# EAGLE design OLED_Adapter (EAGLE 9.5.2)
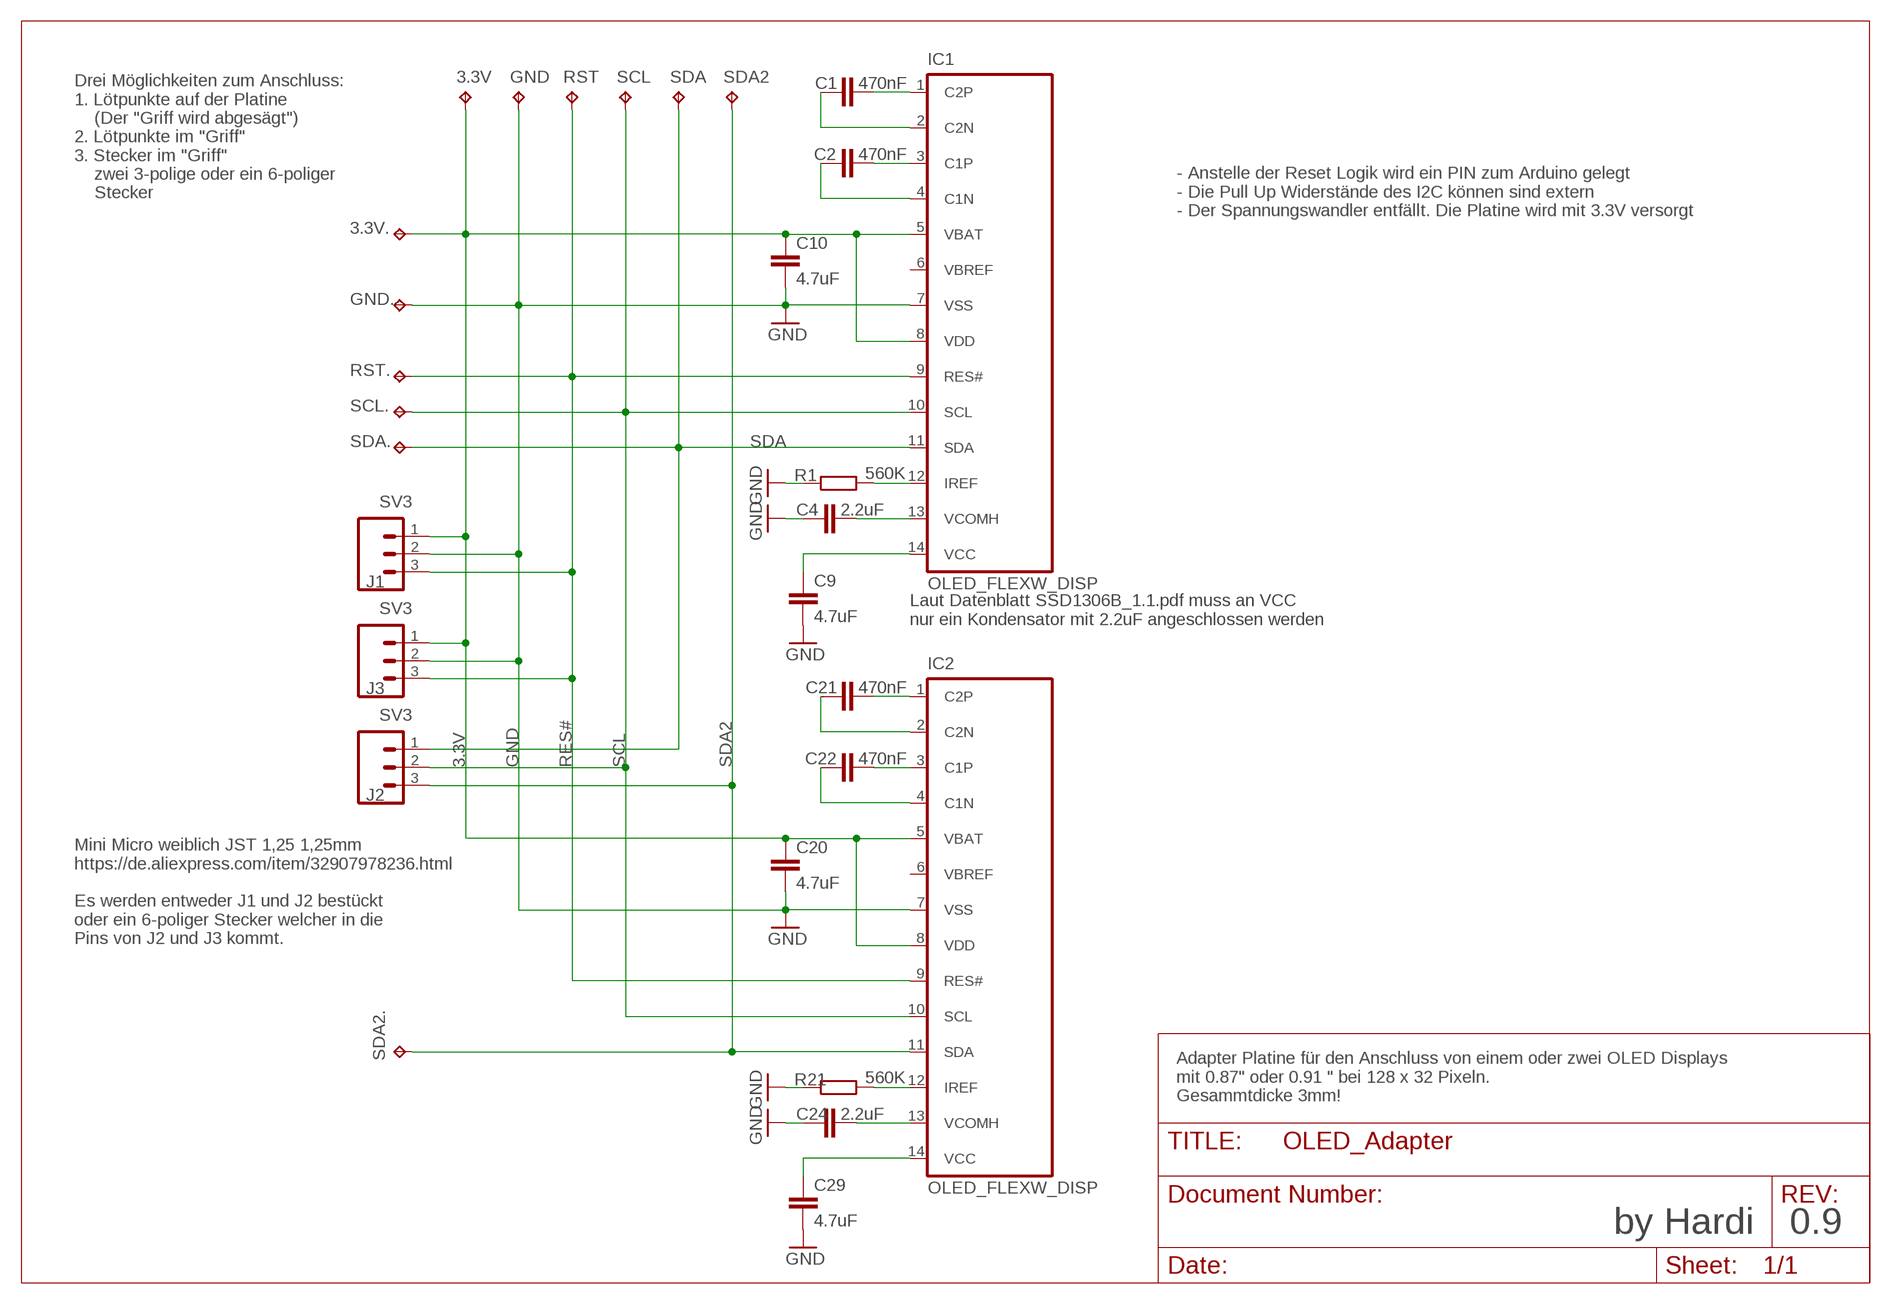
[diagram p0: schematic, sheet 1]

## Parts
3.3V  3.3V  TPTP16SQ  [TP16SQ]
3.3V.  TPTP16SQ  [TP16SQ]
C1  470nF  C-EUC0603  [C0603]
C2  470nF  C-EUC0603  [C0603]
C4  2.2uF  C-EUC0603  [C0603]
C9  4.7uF  C-EUC0603  [C0603]
C10  4.7uF  C-EUC0603  [C0603]
C20  4.7uF  C-EUC0603  [C0603]
C21  470nF  C-EUC0603  [C0603]
C22  470nF  C-EUC0603  [C0603]
C24  2.2uF  C-EUC0603  [C0603]
C29  4.7uF  C-EUC0603  [C0603]
GND  GND  TPTP16R  [TP16R]
GND.  TPTP16R  [TP16R]
IC1  OLED_FLEXW_DISP  [OLED_FLEX_W_DISP]
IC2  OLED_FLEXW_DISP  [OLED_FLEX_W_DISP]
J1  SV3  M03  [MINI]
J2  SV3  M03  [MINI]
J3  SV3  M03  [MINI]
R1  560K  R-EU_R0603  [R0603]
R21  560K  R-EU_R0603  [R0603]
RST  RST  TPTP16R  [TP16R]
RST.  TPTP16R  [TP16R]
SCL  SCL  TPTP16R  [TP16R]
SCL.  TPTP16R  [TP16R]
SDA  SDA  TPTP16R  [TP16R]
SDA2  SDA2  TPTP16R  [TP16R]
SDA2.  TPTP16R  [TP16R]
SDA.  TPTP16R  [TP16R]

## Nets
3.3V: 3.3V..TP 3.3V.TP C10.1 C20.1 IC1.5(VBAT) IC1.8(VDD) IC2.5(VBAT) IC2.8(VDD) J1.1 J3.1
GND: C4.1 C9.2 C10.2 C20.2 C24.1 C29.2 GND..TP GND.TP IC1.7(VSS) IC2.7(VSS) J1.2 J3.2 R1.1 R21.1
N$1: IC1.12(IREF) R1.2
N$2: C21.2 IC2.1(C2P)
N$3: C1.2 IC1.1(C2P)
N$4: C1.1 IC1.2(C2N)
N$5: C2.2 IC1.3(C1P)
N$6: C2.1 IC1.4(C1N)
N$7: C9.1 IC1.14(VCC)
N$8: C4.2 IC1.13(VCOMH)
N$9: C21.1 IC2.2(C2N)
N$10: C22.2 IC2.3(C1P)
N$11: C22.1 IC2.4(C1N)
N$12: IC2.12(IREF) R21.2
N$13: C29.1 IC2.14(VCC)
N$14: C24.2 IC2.13(VCOMH)
RES#: IC1.9(RES#) IC2.9(RES#) J1.3 J3.3 RST..TP RST.TP
SCL: IC1.10(SCL) IC2.10(SCL) J2.2 SCL..TP SCL.TP
SDA: IC1.11(SDA) J2.1 SDA..TP SDA.TP
SDA2: IC2.11(SDA) J2.3 SDA2..TP SDA2.TP
Unconnected: IC1.6(VBREF) IC2.6(VBREF)

## Notes on the sheet
- Drei Möglichkeiten zum Anschluss:
  1. Lötpunkte auf der Platine
      (Der "Griff wird abgesägt")
  2. Lötpunkte im "Griff"
  3. Stecker im "Griff"
      zwei 3-polige oder ein 6-poliger
      Stecker
- - Anstelle der Reset Logik wird ein PIN zum Arduino gelegt
  - Die Pull Up Widerstände des I2C können sind extern
  - Der Spannungswandler entfällt. Die Platine wird mit 3.3V versorgt
- Laut Datenblatt SSD1306B_1.1.pdf muss an VCC
  nur ein Kondensator mit 2.2uF angeschlossen werden
- Mini Micro weiblich JST 1,25 1,25mm
  https://de.aliexpress.com/item/32907978236.html
  
  Es werden entweder J1 und J2 bestückt
  oder ein 6-poliger Stecker welcher in die
  Pins von J2 und J3 kommt.
- Adapter Platine für den Anschluss von einem oder zwei OLED Displays 
  mit 0.87" oder 0.91 " bei 128 x 32 Pixeln.
  Gesammtdicke 3mm!
- by Hardi | 0.9

## Library data of the parts
3.3V 3.3V. GND GND. RST RST. SCL SCL. SDA SDA2 SDA2. SDA. = testpad:TP: Test pad
C1 C2 C4 C9 C10 C20-C22 C24 C29 = resistor:C-EU: CAPACITOR, European symbol
IC1 IC2 = OLED_Flex:OLED_FLEX: 14-Pin OLED Conector 0.91" or 0.86 " Source: https://www.buydisplay.com/white-0-87-inch-oled-display-panel-128x32-iic-i2c-ssd1316 ER-OLED0.87-1_Datasheet.pdf by Hardi
J1-J3 = SparkFun-Connectors:M03: Header 3 Standard 3-pin 0.1" header. Use with straight break away headers (SKU : PRT-00116), right angle break away headers (PRT-00553), swiss pins (PRT-00743), machine pins (PRT-00117), and female headers (PRT-00115). Molex polarized connector foot print use with SKU : PRT-08232 with associated crimp pins and housings.
R1 R21 = rcl:R-EU_: RESISTOR, European symbol; SPICEPREFIX: R

## Board
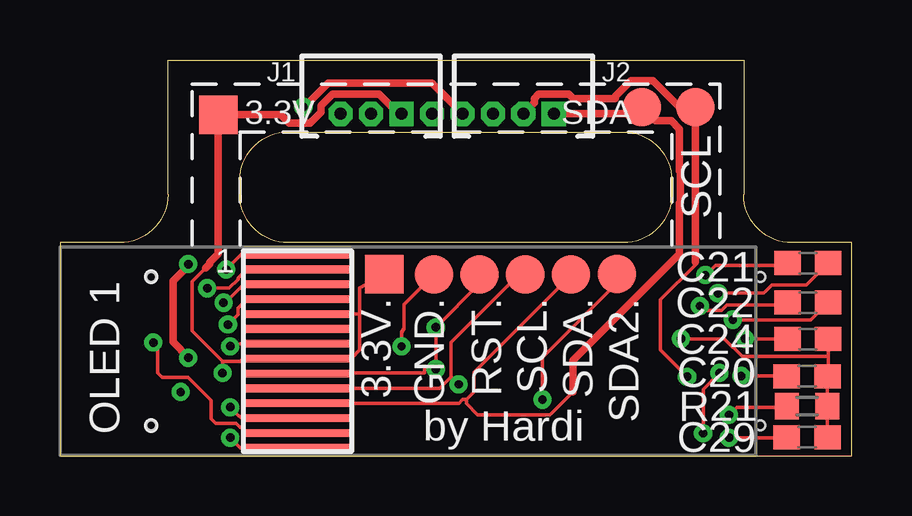
[diagram p1: board, top side]
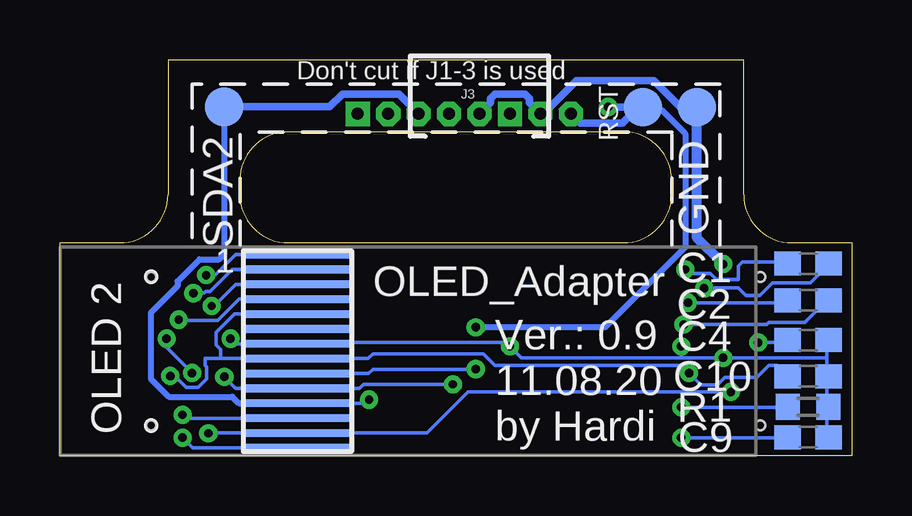
[diagram p2: board, bottom side, seen from below]

Size 33 x 16.5 mm. Coordinates in mm from the lower left corner, seen from the top.
Outline: 0,0 33,0 33,8.88 30.5,8.88 arc-90 28.5,10.88 28.5,16.5 4.5,16.5 4.5,10.88 arc-90 2.5,8.88 0,8.88 0,0
Outline: 23.5,8.88 9.5,8.88 arc-90 7.5,10.88 7.5,11.5 arc-90 9.5,13.5 23.5,13.5 arc-90 25.5,11.5 25.5,10.88 arc-90 23.5,8.88
Copper layers (1*16): Top 0.035mm / dielectric 1.5mm / Bottom 0.035mm
Design rules "default *": minimum track width 6mil, minimum drill 0.35mm, track to track 6mil, track to pad 6mil, pad to pad 6mil, via to via 6mil, smd to smd 6mil, copper to edge 8mil, drill to drill 6mil, minimum pad ring 10mil, minimum via ring 8mil, stop-mask expansion 4mil, vias tented up to drill 0mil, thermal gap 10mil

### Footprints (pad centres in the part's own frame; a part is rotated, then mirrored left to right if it is on the bottom)
TP16SQ = smd 1.6 x 1.6: TP 0,0
C0603 = smd 1.1 x 1: 1 -0.85,0; 2 0.85,0
TP16R = smd 1.6 x 1.6: TP 0,0
OLED_FLEX_W_DISP = smd 4.5 x 0.32: 1 0,0; 2 0,-0.62; 3 0,-1.24; 4 0,-1.86; 5 0,-2.48; 6 0,-3.1; 7 0,-3.72; 8 0,-4.34; 9 0,-4.96; 10 0,-5.58; 11 0,-6.2; 12 0,-6.82; 13 0,-7.44; 14 0,-8.06 | hole 0.4: -6.1,-0.93; -6.1,-7.13
MINI = drill 0.5 pad 1.016 square: 1 -1.27,0 | drill 0.5 pad 1.016 octagon: 2 0,0; 3 1.27,0
R0603 = smd 1 x 1.1: 1 -0.85,0; 2 0.85,0

### Placement (x,y rotation side)
3.3V  6.6,14.22 0 top
3.3V.  13.53,7.56 0 top
C1  1.81,8 180 bottom
C2  1.81,6.48 180 bottom
C4  1.81,4.83 180 bottom
C9  1.81,0.76 0 bottom
C10  1.81,3.3 0 bottom
C20  31.15,3.3 0 top
C21  31.18,8.03 180 top
C22  31.18,6.38 180 top
C24  31.18,4.86 180 top
C29  31.15,0.76 0 top
GND  6.44,14.53 0 bottom
GND.  15.59,7.56 0 top
IC1  9.91,8.38 0 top
IC2  23.09,8.38 0 bottom
J1  12.97,14.26 180 top
J2  19.32,14.26 180 top
J3  15.51,14.26 180 bottom
R1  1.81,2.03 180 bottom
R21  31.15,2.06 180 top
RST  8.7,14.53 0 bottom
RST.  17.49,7.56 0 top
SCL  26.48,14.53 0 top
SCL.  19.4,7.56 0 top
SDA  24.26,14.53 0 top
SDA2  26.16,14.54 0 bottom
SDA2.  23.22,7.57 0 top
SDA.  21.3,7.56 0 top

### Tracks (layer width: path | path; a pad name or v marks a point on that pad's centre or on a via)
3.3V  (via drill 0.35)
  Top 0.152: 3.3V..TP 12.49,6.98 12.49,5.86 | 6.78,3.92 5.51,5.19 5.51,7.26 6.07,7.82 | 6.78,3.92 7.51,3.92 7.63,4.04 IC1.8 9.95,4.08 12.18,4.08 12.49,4.4 12.49,5.86 | v28.4,3.32 30.27,3.32 C20.1 | v6.78,3.45 6.78,3.92 | IC1.5 12.45,5.9 12.49,5.86
  Top 0.305: 6.07,7.82 6.25,7.99 6.25,8.04 6.6,8.4 3.3V.TP 9.2,14.22 9.56,13.86 9.79,13.86 10.43,13.86 10.89,14.31 10.89,14.59 11.36,15.07 13.31,15.07 14.12,14.26 J3.1
  Bottom 0.152: C10.1 2.78,3.45 3.1,3.76 3.45,3.76 3.95,3.26 5.28,3.26 5.59,2.96 6.29,2.96 v6.78,3.45 6.78,3.76 14.88,3.76 15.35,4.24 19.95,4.24 20.15,4.04 IC2.8 26.3,4.04 | 26.3,4.04 26.95,4.04 26.95,3.76 26.89,3.7 26.89,3.19 27.24,2.84 27.74,2.84 28.22,3.32 v28.4,3.32 | 26.3,4.04 26.3,4.43 26.5,4.62 26.5,5.12 25.72,5.9 IC2.5
GND  (via drill 0.35)
  Top 0.152: v14.24,4.55 14.24,5.13 14.34,5.31 14.34,6.3 GND..TP | v7.1,4.56 7.13,4.56 7.23,4.66 IC1.7 | v25.89,4.87 27.7,4.87 28.44,4.13 32,4.13 32.03,4.1 | 5.35,4.1 v5.35,4.08 | C24.1 32.03,4.1 | 32.03,4.1 32.03,3.33 C20.2 R21.1 C29.2
  Top 0.305: v5.35,7.98 5.35,7.91 4.71,7.27 4.71,4.73 5.35,4.1
  Bottom 0.152: C9.2 1.03,0.91 1.03,2.02 R1.1 1.03,2.17 1.03,3.29 C10.2 1.03,3.45 1.03,4.08 | 1.03,4.08 1.03,4.71 C4.1 | 7.1,4.08 13.77,4.08 v14.24,4.55 14.4,4.71 22.97,4.71 IC2.7 25.89,4.66 v25.89,4.87 | 7.1,4.08 v5.35,4.08 1.03,4.08 | 7.1,4.08 v7.1,4.56
  Bottom 0.305: GND.TP 7.14,14.53 8.24,15.64 11.47,15.64 12.85,14.26 J1.2 13.43,14.71 13.43,14.89 13.61,15.07 14.87,15.07 15.05,14.89 15.05,14.71 J3.2
  Bottom 0.406: v5.35,7.98 6.45,9.08 GND.TP
N$1  (via drill 0.35)
  Top 0.152: IC1.12 7.57,1.56 7.47,1.66 7.46,1.66 v7.1,2.02
  Bottom 0.152: v7.1,2.02 2.78,2.02 R1.2
N$2  (via drill 0.35)
  Top 0.152: C21.2 30.23,7.93 27.31,7.93 v26.91,7.53
  Bottom 0.152: IC2.1 25.67,8.38 26.53,7.53 v26.91,7.53
N$3  (via drill 0.35)
  Top 0.152: IC1.1 7.78,8.38 7.76,8.4 7.57,8.4 v6.93,7.76
  Bottom 0.152: v6.93,7.76 6.76,7.59 5.89,7.59 5.64,7.34 4.71,7.34 4.71,7.91 4.54,8.08 2.74,8.08 C1.2
N$4  (via drill 0.35)
  Top 0.152: v6.14,6.98 7.06,6.98 7.43,7.35 7.43,7.4 7.79,7.76 IC1.2
  Bottom 0.152: C1.1 1.03,7.89 1.72,7.21 3.3,7.21 3.83,6.68 4.41,6.68 4.71,6.98 v6.14,6.98
N$5  (via drill 0.35)
  Top 0.152: IC1.3 7.65,7.14 6.88,6.37 v6.82,6.37
  Bottom 0.152: v6.82,6.37 2.76,6.37 C2.2
N$6  (via drill 0.35)
  Top 0.152: v7,5.46 7.43,5.89 7.43,6.16 7.79,6.52 IC1.4
  Bottom 0.152: C2.1 1.03,6.46 1.94,5.55 3.45,5.55 3.54,5.46 v7,5.46
N$7  (via drill 0.35)
  Top 0.152: IC1.14 7.52,0.32 v7.1,0.75
  Bottom 0.152: v7.1,0.75 2.78,0.75 C9.1
N$8  (via drill 0.35)
  Top 0.152: IC1.13 7.76,0.94 7.35,1.35 6.49,1.35 6.3,1.54 6.3,2.3 5.35,3.26 4.27,3.26 4.08,3.45 4.08,4.52 v3.89,4.71
  Bottom 0.152: v3.89,4.71 2.78,4.71 C4.2
N$9  (via drill 0.35)
  Top 0.152: C21.1 31.11,7.11 29.68,7.11 29.34,6.77 v27.44,6.77
  Bottom 0.152: IC2.2 25.81,7.76 26.73,6.84 26.93,6.84 27,6.77 v27.44,6.77
N$10  (via drill 0.35)
  Top 0.152: C22.2 30.22,6.27 27.8,6.27 27.58,6.05 26.86,6.05 v26.68,6.24
  Bottom 0.152: IC2.3 25.67,7.14 26.57,6.24 v26.68,6.24
N$11  (via drill 0.35)
  Top 0.152: C22.1 31.3,5.65 28.11,5.65 28.1,5.67 v28.05,5.67
  Bottom 0.152: v28.05,5.67 28.02,5.63 26.42,5.63 25.53,6.52 IC2.4
N$12  (via drill 0.35)
  Top 0.152: R21.2 30.27,2.02 28.21,2.02 v27.89,1.7
  Bottom 0.152: IC2.12 27.76,1.56 v27.89,1.7
N$13  (via drill 0.35)
  Top 0.152: v27.89,0.75 30.27,0.75 C29.1
  Bottom 0.152: IC2.14 27.47,0.32 v27.89,0.75
N$14  (via drill 0.35)
  Top 0.152: v28.56,4.87 30.27,4.87 C24.2 | v26.81,0.93 26.81,2.77 v27.49,3.45
  Bottom 0.152: v5.03,2.65 15.99,2.65 17.7,0.94 IC2.13 26.6,0.94 26.69,1.03 26.71,1.03 v26.81,0.93 | v27.49,3.45 28.56,4.51 v28.56,4.87
RES#  (via drill 0.35)
  Top 0.152: IC1.9 9.95,3.45 15.19,3.45 15.19,3.6 v15.67,3.6 v15.67,3.61 v15.67,5.35 17.49,7.17 RST..TP
  Top 0.305: v10.15,14.54 10.19,14.54 11.17,15.53 15.51,15.53 J3.3
  Bottom 0.152: v15.67,3.6 19.95,3.6 20.14,3.42 IC2.9
  Bottom 0.254: RST.TP 8.56,14.39 7.89,14.39 6.93,13.43 6.93,8.69 7.2,8.42 | 7.2,8.42 | v15.67,5.35 10.27,5.35 7.2,8.42
  Bottom 0.305: J1.3 11.3,13.86 9.56,13.86 8.88,14.53 RST.TP v10.14,14.53 v10.15,14.54
SCL  (via drill 0.35)
  Top 0.152: 16.3,3.29 16.3,4.73 19.13,7.56 SCL..TP | 16.3,3.29 15.83,2.81 9.95,2.81 IC1.10 | v16.62,2.97 16.3,3.29 | v26.15,3.29 25.04,4.4 25.04,6.51 26.48,7.96 26.48,8.06
  Top 0.305: 26.48,8.06 SCL.TP 25.82,14.53 24.71,15.64 23.8,15.64 23.15,14.99 23.15,14.91 23.13,14.89 21.4,14.89 21.22,15.07 19.96,15.07 19.78,14.89 19.78,14.71 J2.2
  Bottom 0.152: v26.15,3.29 25.67,2.81 23.13,2.81 IC2.10 20.5,2.8 20.34,2.97 v16.62,2.97
SDA
  Top 0.152: 16.94,2.33 17.26,2.65 17.26,3.46 21.3,7.51 SDA..TP | 16.94,2.33 16.78,2.33 16.63,2.18 IC1.11 | 21.39,2.66 20.43,1.7 17.41,1.7 16.94,2.17 16.94,2.33
  Top 0.305: 21.39,2.66 21.39,3.96 25.83,8.4 25.83,10.52 25.86,10.55 25.86,11.83 25.83,11.86 25.83,13.62 25.49,13.96 24.83,13.96 SDA.TP 23.98,14.26 J2.1
SDA2  (via drill 0.35)
  Top 0.152: v20.11,2.33 20.11,4.1 23.22,7.2 SDA2..TP
  Bottom 0.152: IC2.11 20.27,2.18 v20.11,2.33
  Bottom 0.254: SDA2.TP 26.16,8.39 26.37,8.18 27.18,8.18 28.1,7.27 28.1,7.07 29.21,5.95 29.21,3.2 28.47,2.45 25.82,2.45 25.55,2.18 IC2.11
  Bottom 0.305: SDA2.TP 21.75,14.54 21.22,15.07 18.86,15.07 J2.3

### Text on the board
tPlace: OLED 1 | by Hardi
bPlace: Don't cut if J1-3 is used | OLED_Adapter | OLED 2 | Ver.: 0.9 | 11.08.20 | by Hardi